# EAGLE design mouse_shield (EAGLE 5.11)
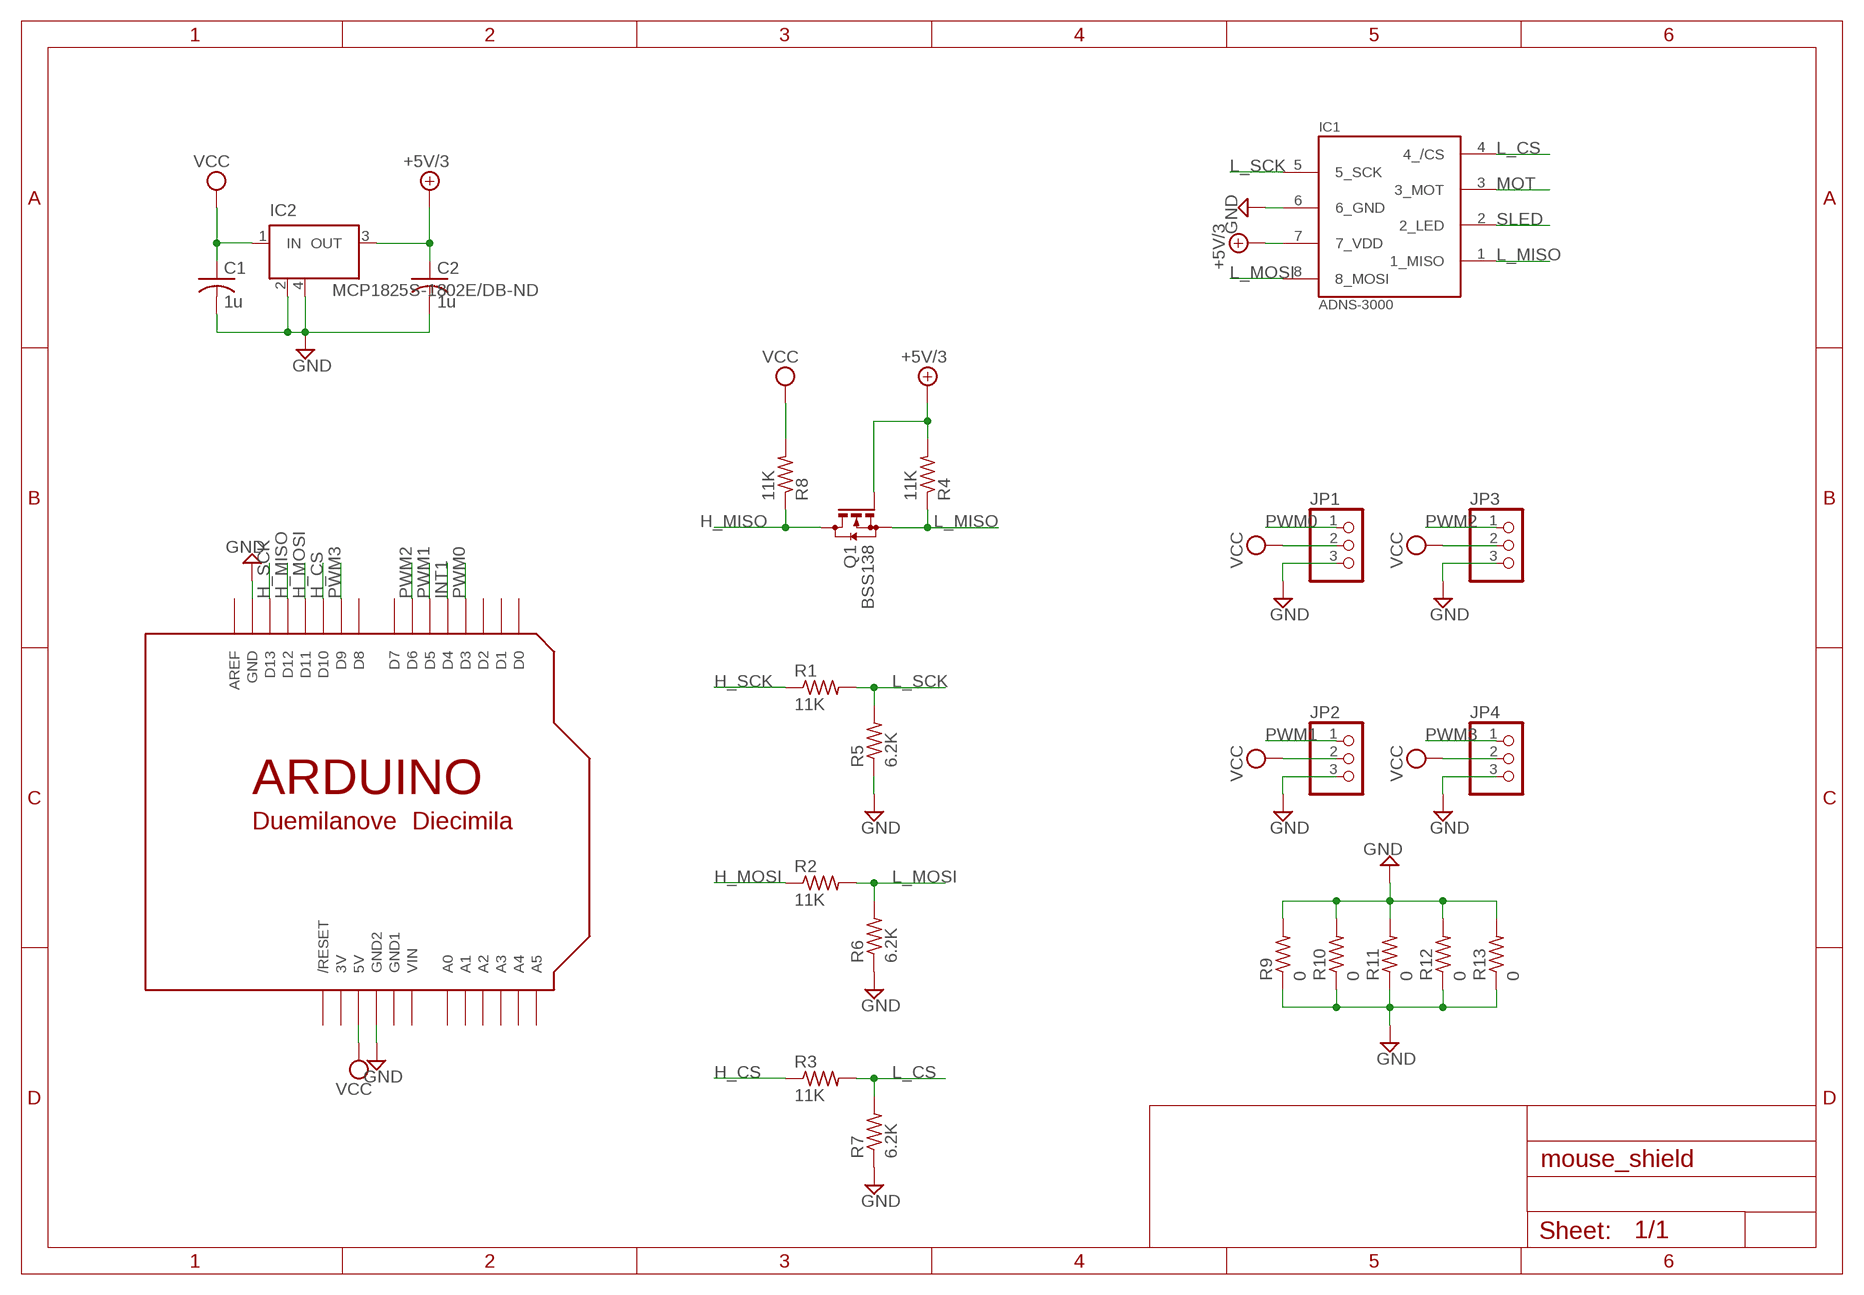
[diagram p0: schematic, sheet 1]

## Parts
C1  1u  C-USC1206  [C1206]
C2  1u  C-USC1206  [C1206]
IC1  ADNS-3000  [ADNS-3000]
IC2  MCP1825S-1802E/DB-ND  LM340S  [SOT223]
JP1  PINHD-1X3/90  [1X03/90]
JP2  PINHD-1X3/90  [1X03/90]
JP3  PINHD-1X3/90  [1X03/90]
JP4  PINHD-1X3/90  [1X03/90]
Q1  BSS138  BSS123  [SOT23]
R1  11K  R-US_R1206  [R1206]
R2  11K  R-US_R1206  [R1206]
R3  11K  R-US_R1206  [R1206]
R4  11K  R-US_R1206  [R1206]
R5  6.2K  R-US_R1206  [R1206]
R6  6.2K  R-US_R1206  [R1206]
R7  6.2K  R-US_R1206  [R1206]
R8  11K  R-US_R1206  [R1206]
R9  0  R-US_R1206  [R1206]
R10  0  R-US_R1206  [R1206]
R11  0  R-US_R1206  [R1206]
R12  0  R-US_R1206  [R1206]
R13  0  R-US_R1206  [R1206]
U$1  ARDUINO-NOHOLE  [ARDUINO-NOHOLE]

## Nets
+5V/3: C2.1 IC1.7(7_VDD) IC2.3(OUT) Q1.1(G) R4.2
GND: C1.2 C2.2 IC1.6(6_GND) IC2.2(GND) IC2.4(GND) JP1.3 JP2.3 JP3.3 JP4.3 R5.1 R6.1 R7.1 R9.1 R9.2 R10.1 R10.2 R11.1 R11.2 R12.1 R12.2 R13.1 R13.2 U$1.GND U$1.GND2
H_CS: R3.1 U$1.D10
H_MISO: Q1.3(D) R8.1 U$1.D12
H_MOSI: R2.1 U$1.D11
H_SCK: R1.1 U$1.D13
INT1: U$1.D4
L_CS: IC1.4(4_/CS) R3.2 R7.2
L_MISO: IC1.1(1_MISO) Q1.2(S) R4.1
L_MOSI: IC1.8(8_MOSI) R2.2 R6.2
L_SCK: IC1.5(5_SCK) R1.2 R5.2
MOT: IC1.3(3_MOT)
PWM0: JP1.1 U$1.D3
PWM1: JP2.1 U$1.D5
PWM2: JP3.1 U$1.D6
PWM3: JP4.1 U$1.D9
SLED: IC1.2(2_LED)
VCC: C1.1 IC2.1(IN) JP1.2 JP2.2 JP3.2 JP4.2 R8.2 U$1.5V
Unconnected: U$1.A0 U$1.A1 U$1.A2 U$1.A3 U$1.A4 U$1.A5 U$1.AREF U$1.D0 U$1.D1 U$1.D2 U$1.D7 U$1.D8 U$1.RESET(/RESET)

## Power pins joined to a net without a drawn wire
3V: U$1.3V
GND1: U$1.GND1
VIN: U$1.VIN

## Library data of the parts
C1 C2 = rcl:C-US: CAPACITOR, American symbol
IC1 = avago:ADNS-3000
IC2 = linear:LM340S: 3-Terminal Positive Regulators Source: http://cache.national.com/ds/LM/LM340.pdf
JP1-JP4 = pinhead:PINHD-1X3: PIN HEADER
Q1 = transistor-small-signal:BSS123: N-CHANNEL MOS FET
R1-R13 = rcl:R-US_: RESISTOR, American symbol
U$1 = adafruit:ARDUINO: Arduino Diecimila/Duemilanove Make a shield with ease, this package has all the named pins as well as the two mounting drill holes and an outline of the USB and DC power connector. The outline is on the DIMENSION layer, so if your board house uses it they will cut the outline to match. http://www.ladyada.net/library/pcb/eaglelibrary.html

## Board
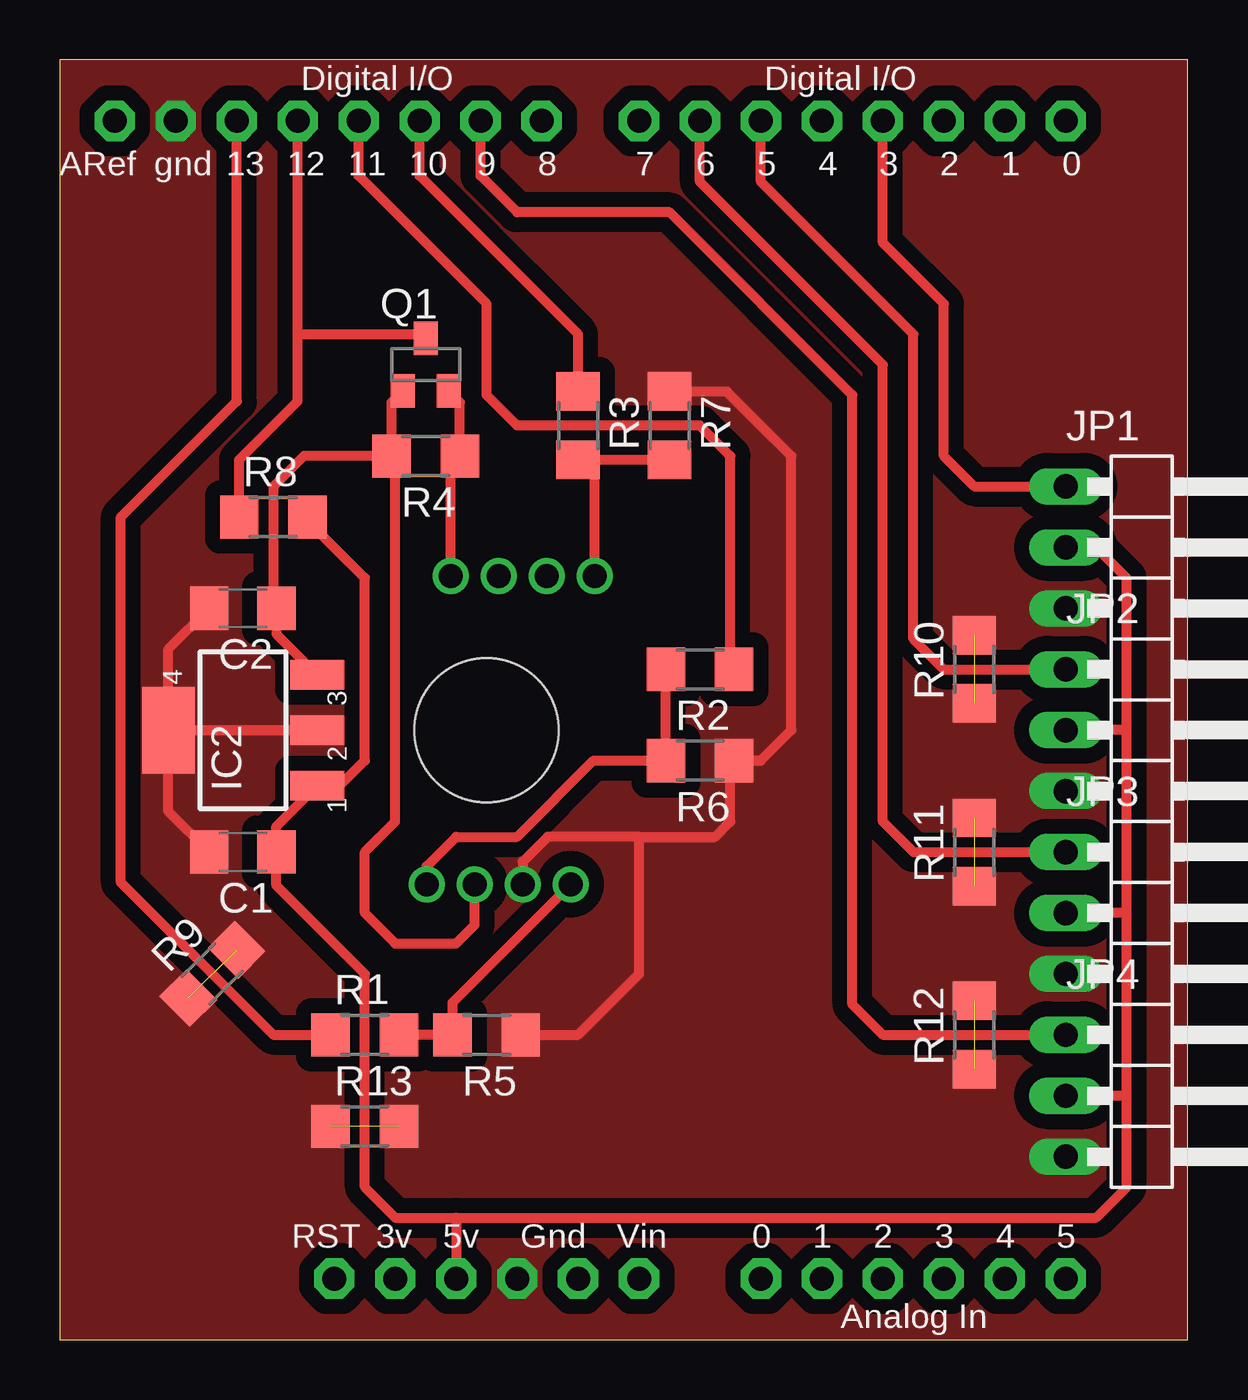
[diagram p1: board, top side]
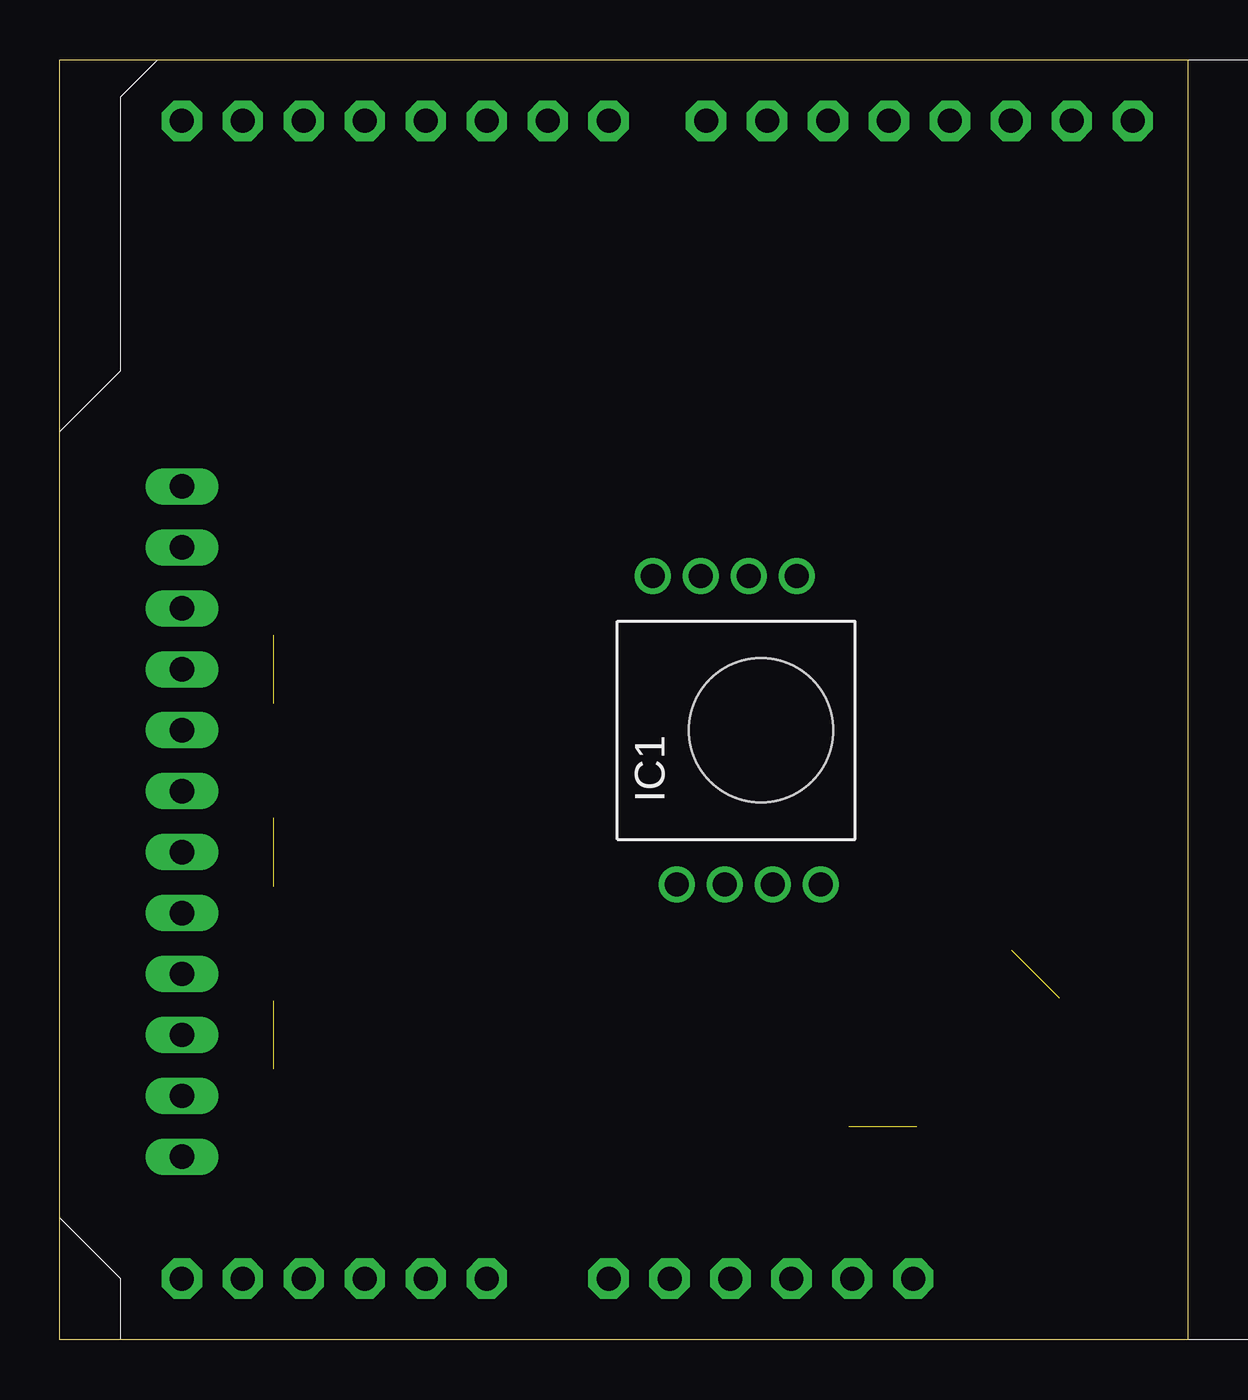
[diagram p2: board, bottom side, seen from below]

Size 46.99 x 53.34 mm. Coordinates in mm from the lower left corner, seen from the top.
Outline: 0,0 46.99,0 46.99,53.34 0,53.34 0,0
Copper layers (1*16): Top 0.035mm / dielectric 1.5mm / Bottom 0.035mm
Design rules "fab *": minimum track width 12mil, minimum drill 1mm, track to track 15.5mil, track to pad 15.5mil, pad to pad 15mil, via to via 15mil, smd to smd 10mil, copper to edge 0mil, drill to drill 1mm, minimum pad ring 0.2mm, minimum via ring 0.2mm, stop-mask expansion 4mil, vias tented up to drill 0mil, thermal gap 1mm

### Footprints (pad centres in the part's own frame; a part is rotated, then mirrored left to right if it is on the bottom)
C1206 = smd 1.6 x 1.8: 1 -1.4,0; 2 1.4,0
ADNS-3000 = drill 1 round: 1 1.5,6.425; 2 -0.5,6.425; 3 -2.5,6.425; 4 -4.5,6.425; 5 -3.5,-6.425; 6 -1.5,-6.425; 7 0.5,-6.425; 8 2.5,-6.425 | hole 6: 0,0
SOT223 = smd 1.219 x 2.235: 1 -2.311,-3.099; 2 0,-3.099; 3 2.311,-3.099 | smd 3.6 x 2.2: 4 0,3.099
1X03/90 = drill 1.016 long: 1 -2.54,-3.81; 2 0,-3.81; 3 2.54,-3.81
SOT23 = smd 1 x 1.4: 1 -0.95,-1.1; 2 0.95,-1.1; 3 0,1.1
R1206 = smd 1.6 x 1.803: 1 -1.422,0; 2 1.422,0
ARDUINO-NOHOLE = drill 1 pad 1.676 octagon: 3V 35.56,2.54; 5V 38.1,2.54; A0 50.8,2.54; A1 53.34,2.54; A2 55.88,2.54; A3 58.42,2.54; A4 60.96,2.54; A5 63.5,2.54; AREF 23.876,50.8; D0 63.5,50.8; D1 60.96,50.8; D2 58.42,50.8; D3 55.88,50.8; D4 53.34,50.8; D5 50.8,50.8; D6 48.26,50.8; D7 45.72,50.8; D8 41.656,50.8; D9 39.116,50.8; D10 36.576,50.8; D11 34.036,50.8; D12 31.496,50.8; D13 28.956,50.8; GND 26.416,50.8; GND1 43.18,2.54; GND2 40.64,2.54; RESET 33.02,2.54; VIN 45.72,2.54

### Placement (x,y rotation side)
C1  7.62,20.32 180 top
C2  7.62,30.48 180 top
IC1  17.78,25.4 0 bottom
IC2  7.62,25.4 90 top
JP1  45.72,33.02 270 top
JP2  45.72,25.4 270 top
JP3  45.72,17.78 270 top
JP4  45.72,10.16 270 top
Q1  15.24,40.64 0 top
R1  12.7,12.7 0 top
R2  26.67,27.94 180 top
R3  21.59,38.1 270 top
R4  15.24,36.83 180 top
R5  17.78,12.7 180 top
R6  26.67,24.13 180 top
R7  25.4,38.1 270 top
R8  8.89,34.29 0 top
R9  6.35,15.24 45 top
R10  38.1,27.94 90 top
R11  38.1,20.32 90 top
R12  38.1,12.7 90 top
R13  12.7,8.89 0 top
U$1  -21.59,0 0 top

### Tracks (layer width: path | path; a pad name or v marks a point on that pad's centre or on a via)
+5V/3
  Top 0.406: Q1.1 13.82,39.07 R4.2 | IC2.3 9.02,29.41 C2.1 8.89,30.61 8.89,35.56 10.16,36.83 R4.2 | R4.2 13.97,36.68 13.97,21.59 12.7,20.32 12.7,17.78 13.97,16.51 16.51,16.51 17.28,17.28 IC1.7
GND  (5 unrouted)
  Top 0.406: R7.1 27.79,39.52 30.48,36.83 30.48,25.4 29.21,24.13 R6.1 | R6.1 27.94,24.13 | IC2.4 IC2.2 | IC2.4 4.52,28.78 C2.2 | IC2.4 4.52,22.02 C1.2 | 24.13,20.95 27.31,20.95 27.94,21.59 27.94,23.98 R6.1 | R5.1 21.59,12.7 24.13,15.24 24.13,20.95 | IC1.6 19.28,19.91 20.32,20.95 24.13,20.95
  pour Top (isolate 0.635, no thermals): 0,53.34 46.99,53.34 46.99,0 0,0
H_CS
  Top 0.406: U$1.D10 14.99,48.51 21.59,41.91 R3.1
H_MISO
  Top 0.406: 9.91,41.91 9.91,39.12 7.47,36.68 R8.1 | 9.91,41.91 U$1.D12 | Q1.3 15.07,41.91 9.91,41.91
H_MOSI
  Top 0.406: R2.1 27.94,28.09 27.94,36.83 26.67,38.1 19.05,38.1 17.78,39.37 17.78,43.18 12.45,48.51 U$1.D11
H_SCK
  Top 0.406: U$1.D13 7.37,39.12 2.54,34.29 2.54,19.05 8.89,12.7 R1.1
L_CS
  Top 0.406: R7.2 R3.2 22.28,35.99 IC1.4
L_MISO
  Top 0.406: Q1.2 16.66,39.07 R4.1 16.28,36.45 IC1.1
L_MOSI
  Top 0.406: R2.2 R6.2 22.22,24.13 19.05,20.95 16.51,20.95 15.28,19.73 IC1.8
L_SCK
  Top 0.406: IC1.5 16.36,14.05 R5.2 R1.2
PWM0
  Top 0.406: U$1.D3 34.29,45.72 36.83,43.18 36.83,36.83 38.1,35.56 JP1.1
PWM1
  Top 0.406: U$1.D5 29.21,48.26 35.56,41.91 35.56,29.21 36.83,27.94 JP2.1
PWM2
  Top 0.406: U$1.D6 26.67,48.26 34.29,40.64 34.29,21.59 35.56,20.32 JP3.1
PWM3
  Top 0.406: U$1.D9 17.53,48.51 19.05,46.99 25.4,46.99 33.02,39.37 33.02,13.97 34.29,12.7 JP4.1
VCC
  Top 0.406: 16.51,5.08 43.18,5.08 44.45,6.35 44.45,10.16 | 16.51,5.08 U$1.5V | R8.2 10.31,34.14 12.7,31.75 12.7,24.13 11.43,22.86 10.95,22.86 IC2.1 9.02,21.39 C1.1 9.02,18.92 12.7,15.24 12.7,6.35 13.97,5.08 16.51,5.08 | 44.45,10.16 44.45,17.78 | 44.45,17.78 44.45,25.4 | 44.45,25.4 44.45,31.75 43.18,33.02 JP1.2 | 44.45,25.4 JP2.2 | 44.45,17.78 JP3.2 | 44.45,10.16 JP4.2